# EAGLE schematic cas48 (EAGLE 5.10)
DRAWING_NAME: Unioc 2010; REV: 46
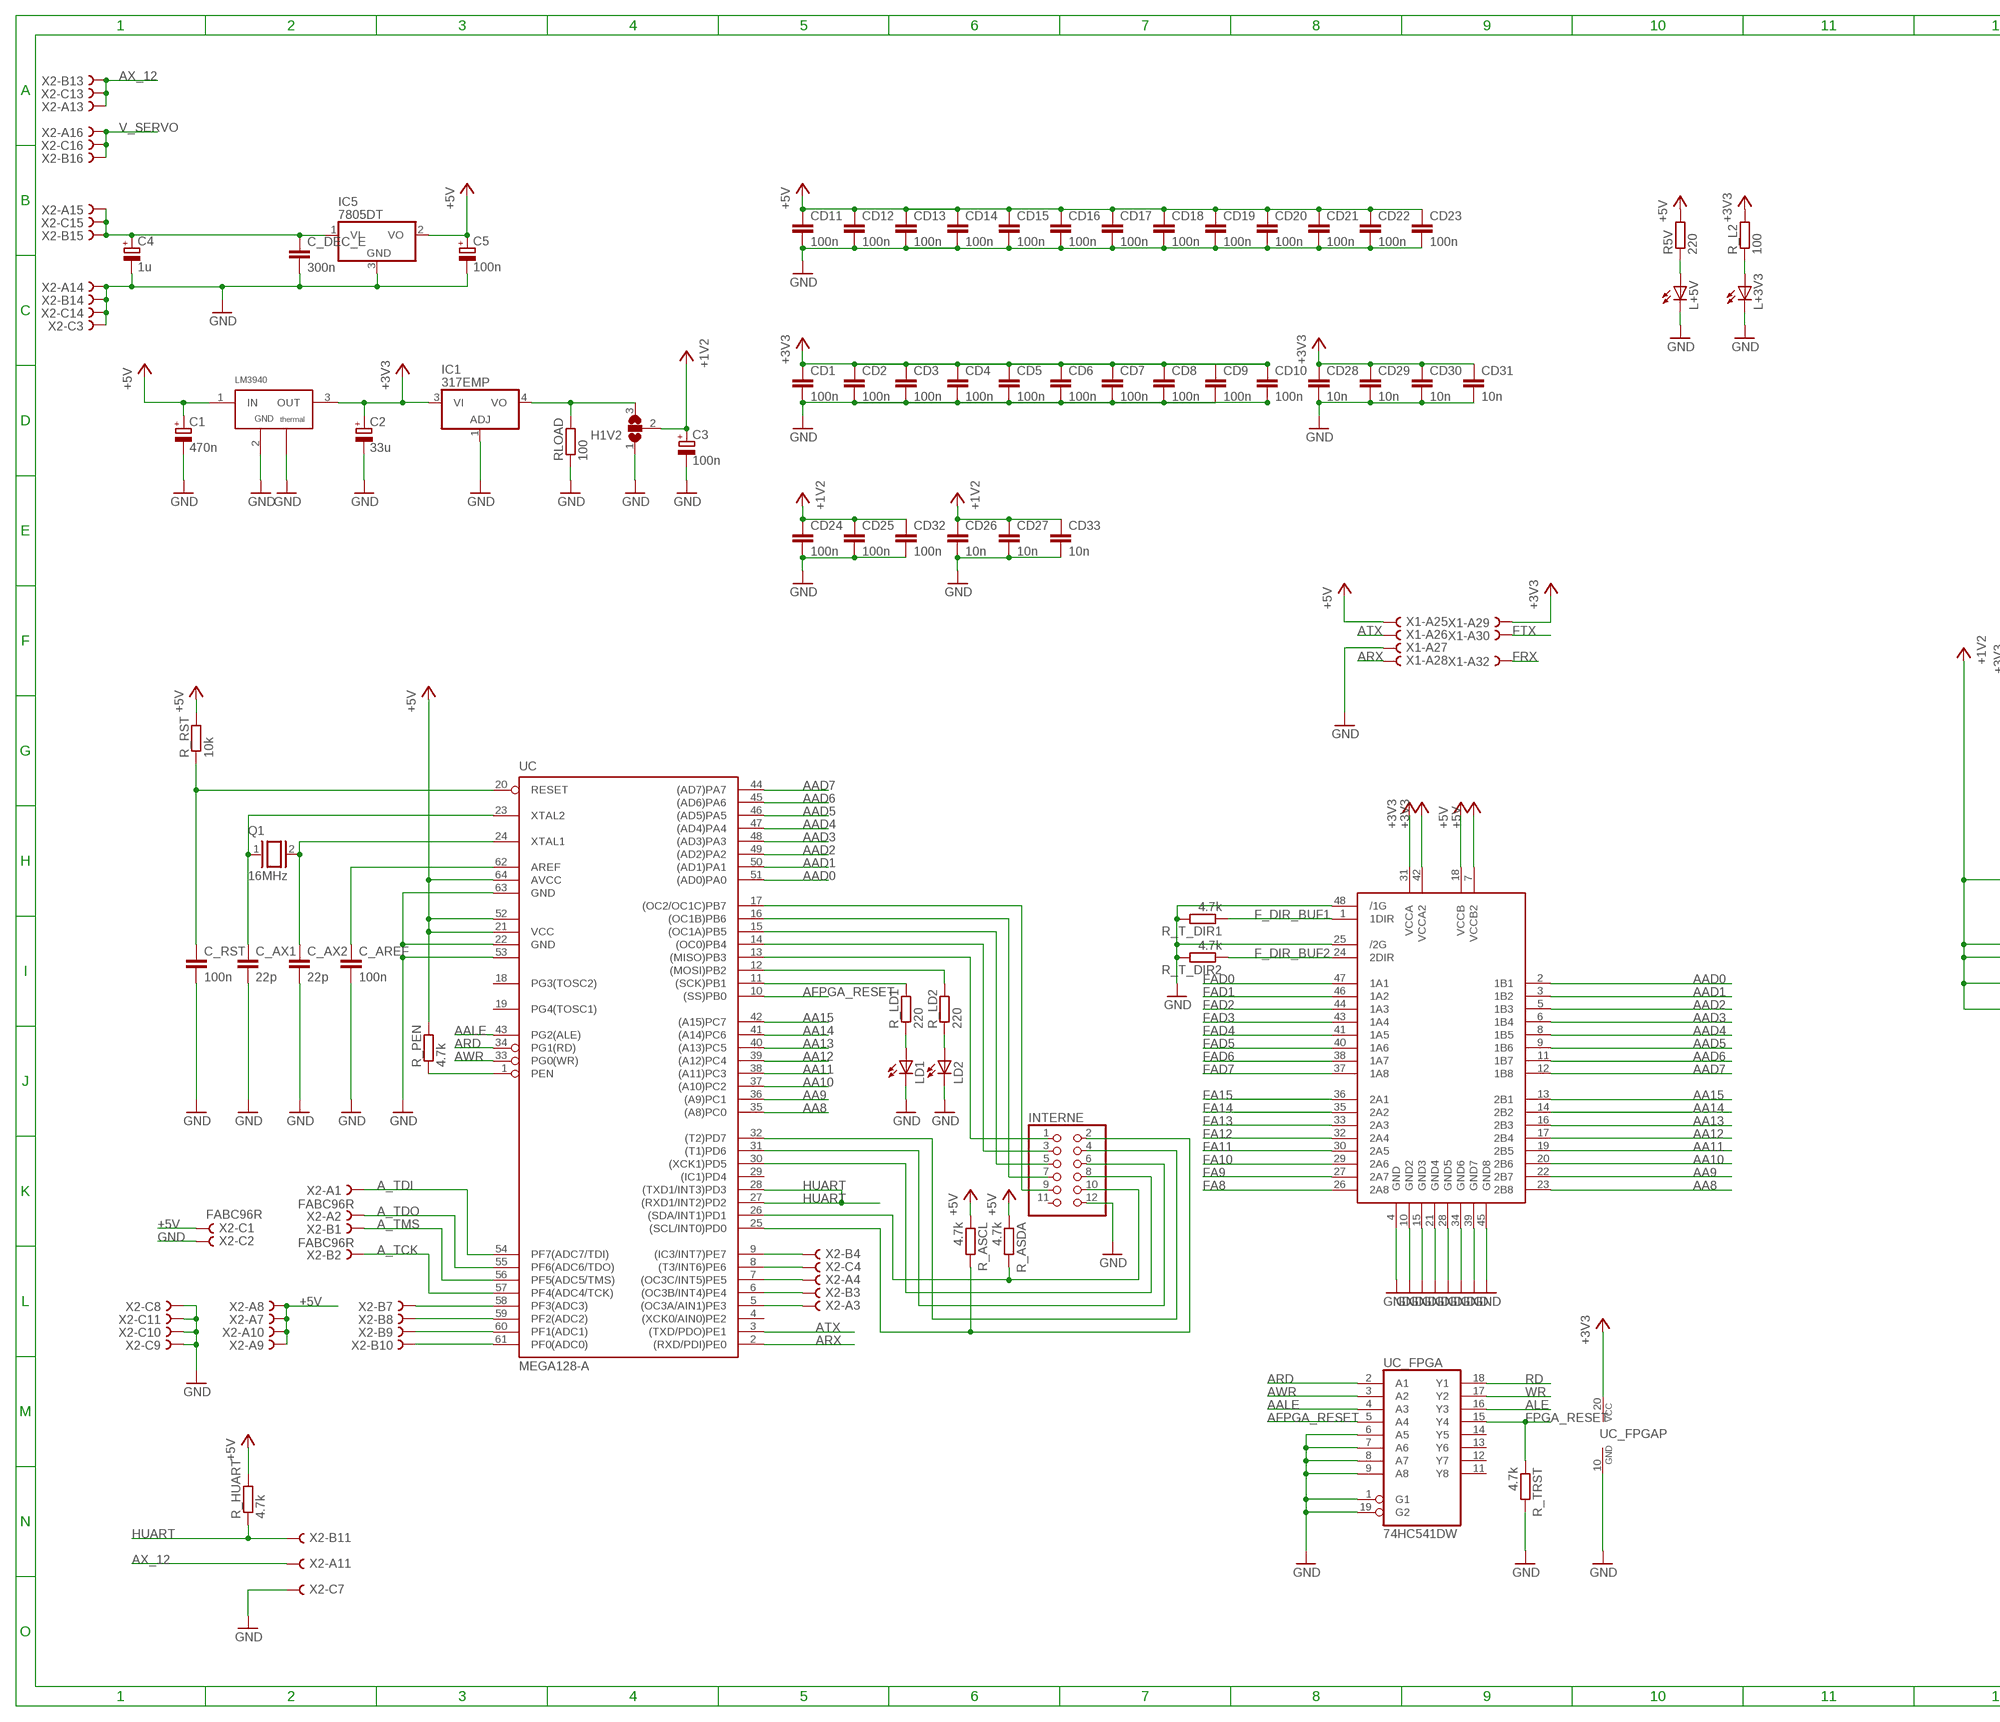
[diagram p0: schematic, sheet 1, part 1 of 2]
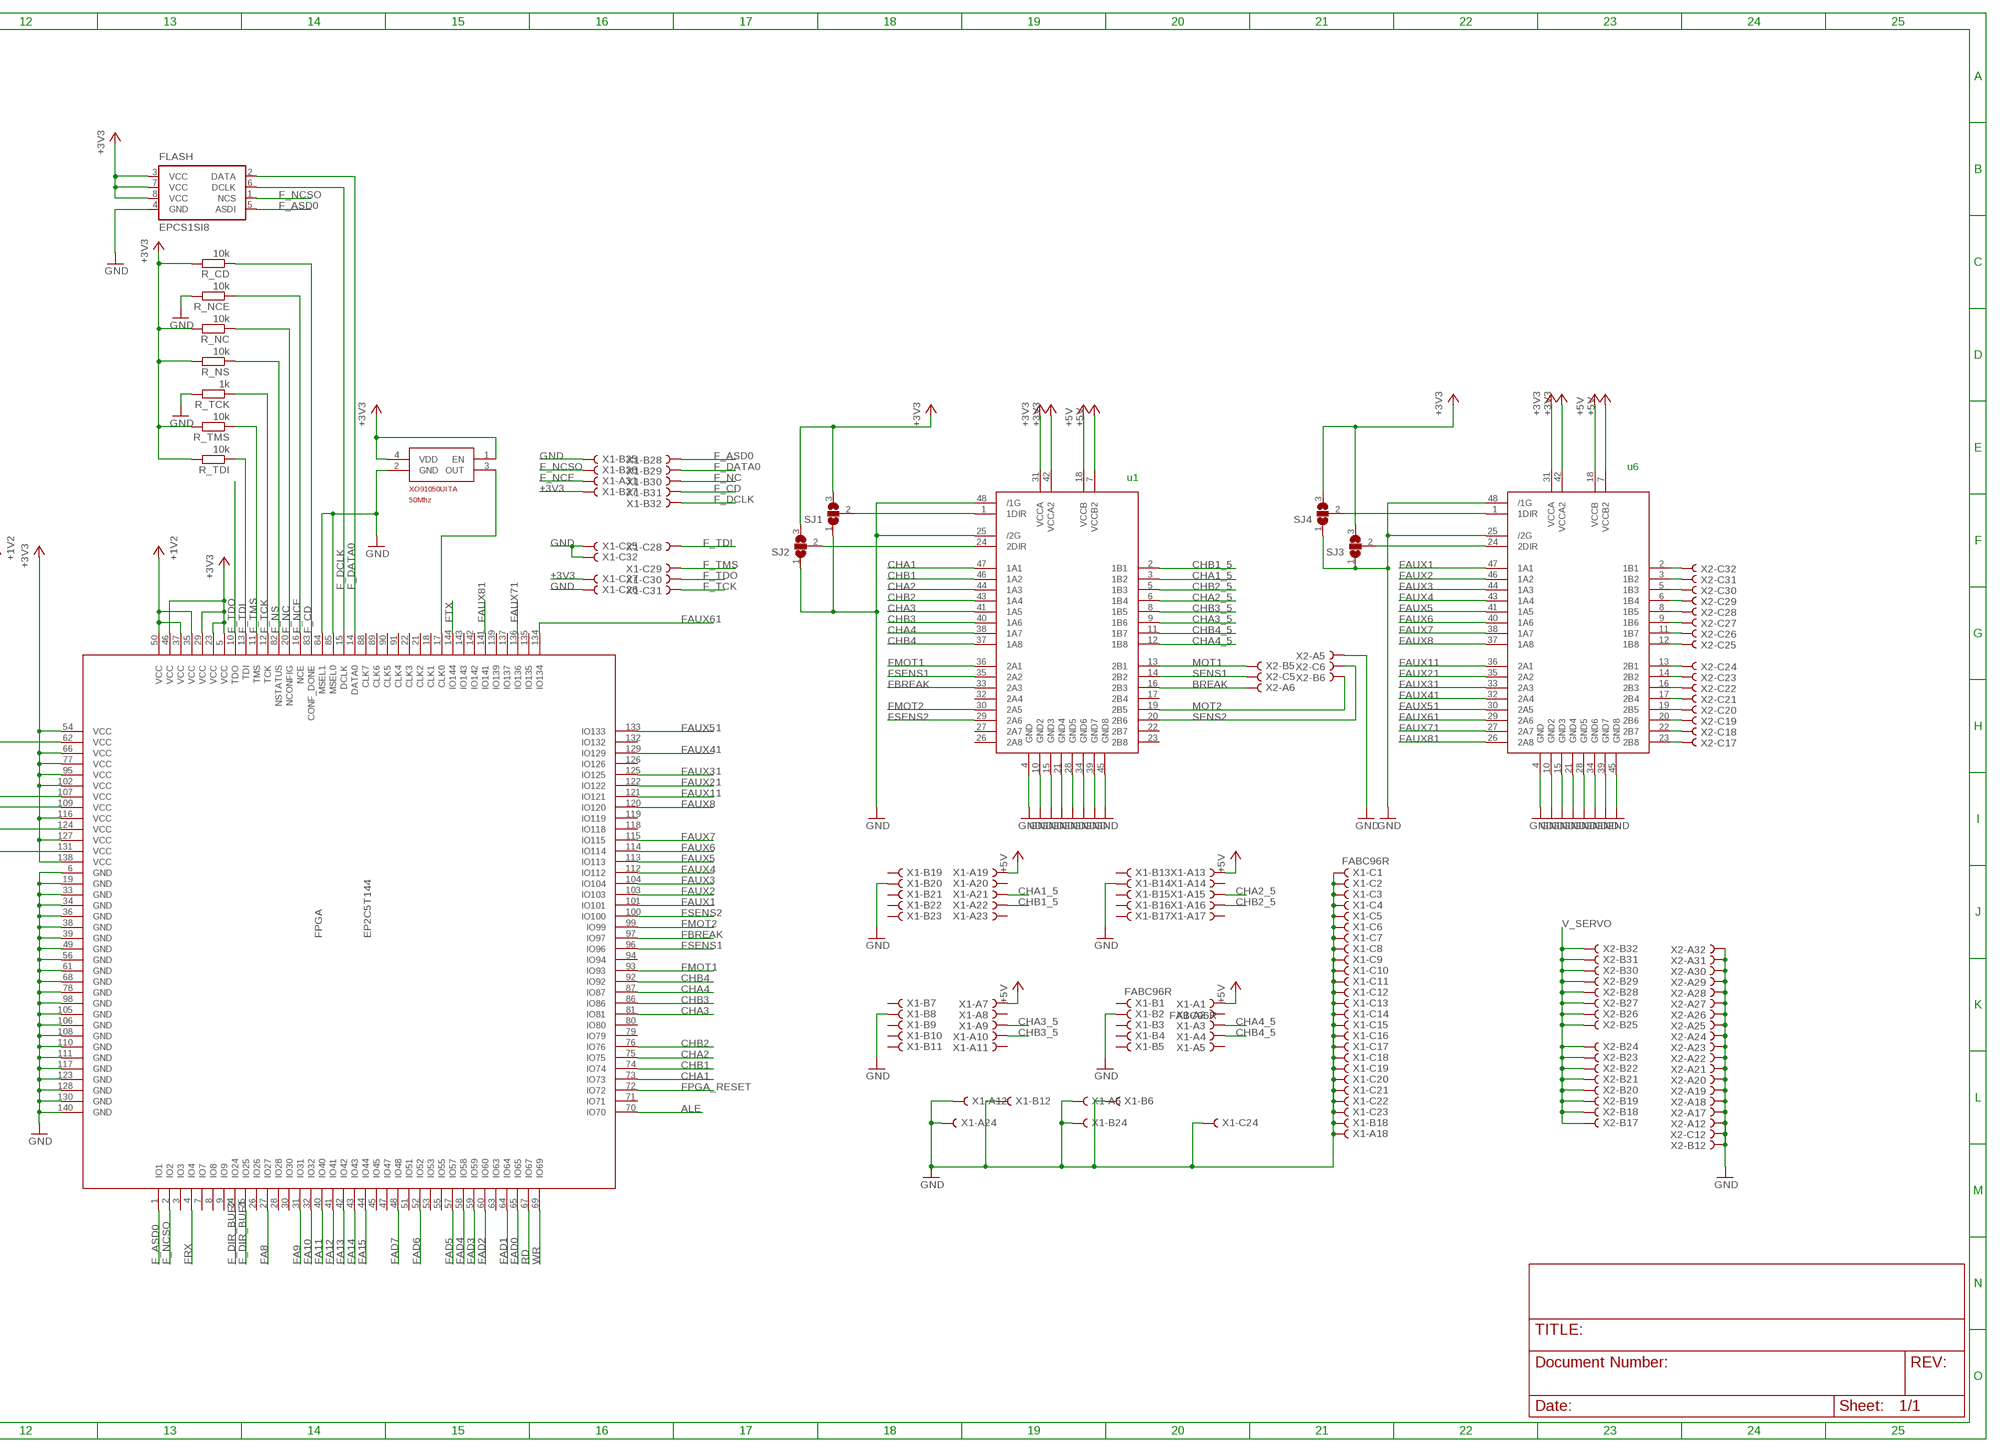
[diagram p1: schematic, sheet 1, part 2 of 2]

## Parts
C1  470n  CPOL-EUE1.8-4  [E1,8-4]
C2  33u  CPOL-EUE1.8-4  [E1,8-4]
C3  100n  CPOL-EUE1.8-4  [E1,8-4]
C4  1u  CPOL-EUE1.8-4  [E1,8-4]
C5  100n  CPOL-EUE1.8-4  [E1,8-4]
C_AREF  100n  C-EUC0805  [C0805]
C_AX1  22p  C-EUC0805  [C0805]
C_AX2  22p  C-EUC0805  [C0805]
C_DEC_E  300n  C-EUC0805  [C0805]
C_RST  100n  C-EUC0805  [C0805]
CD1  100n  C-EUC0805  [C0805]
CD2  100n  C-EUC0805  [C0805]
CD3  100n  C-EUC0805  [C0805]
CD4  100n  C-EUC0805  [C0805]
CD5  100n  C-EUC0805  [C0805]
CD6  100n  C-EUC0805  [C0805]
CD7  100n  C-EUC0805  [C0805]
CD8  100n  C-EUC0805  [C0805]
CD9  100n  C-EUC0805  [C0805]
CD10  100n  C-EUC0805  [C0805]
CD11  100n  C-EUC0805  [C0805]
CD12  100n  C-EUC0805  [C0805]
CD13  100n  C-EUC0805  [C0805]
CD14  100n  C-EUC0805  [C0805]
CD15  100n  C-EUC0805  [C0805]
CD16  100n  C-EUC0805  [C0805]
CD17  100n  C-EUC0805  [C0805]
CD18  100n  C-EUC0805  [C0805]
CD19  100n  C-EUC0805  [C0805]
CD20  100n  C-EUC0805  [C0805]
CD21  100n  C-EUC0805  [C0805]
CD22  100n  C-EUC0805  [C0805]
CD23  100n  C-EUC0805  [C0805]
CD24  100n  C-EUC0805  [C0805]
CD25  100n  C-EUC0805  [C0805]
CD26  10n  C-EUC0805  [C0805]
CD27  10n  C-EUC0805  [C0805]
CD28  10n  C-EUC0805  [C0805]
CD29  10n  C-EUC0805  [C0805]
CD30  10n  C-EUC0805  [C0805]
CD31  10n  C-EUC0805  [C0805]
CD32  100n  C-EUC0805  [C0805]
CD33  10n  C-EUC0805  [C0805]
FLASH  EPCS1SI8  [SO08]
FPGA  EP2C5T144  [TQFP144]
H1V2  SJ2W  [SJ_2]
IC1  317EMP  [SOT223]
IC5  7805DT  [TO252]
INTERNE  PINHD-2X6  [2X06]
L+3V3  LEDCHIPLED_0805  [CHIPLED_0805]
L+5V  LEDCHIPLED_0805  [CHIPLED_0805]
LD1  LEDCHIPLED_0805  [CHIPLED_0805]
LD2  LEDCHIPLED_0805  [CHIPLED_0805]
OSC_FPGA  XO91050UITA-50MHZLEVRAI  [SMD_Q_NG]
Q1  16MHz  XTAL/S  [QS]
R5V  220  R-EU_R0805  [R0805]
R_ASCL  4.7k  R-EU_R0805  [R0805]
R_ASDA  4.7k  R-EU_R0805  [R0805]
R_CD  10k  R-EU_R0805  [R0805]
R_HUART  4.7k  R-EU_R0805  [R0805]
R_L2  100  R-EU_R0805  [R0805]
R_LD1  220  R-EU_R0805  [R0805]
R_LD2  220  R-EU_R0805  [R0805]
R_NC  10k  R-EU_R0805  [R0805]
R_NCE  10k  R-EU_R0805  [R0805]
R_NS  10k  R-EU_R0805  [R0805]
R_PEN  4.7k  R-EU_R0805  [R0805]
R_RST  10k  R-EU_R0805  [R0805]
R_T_DIR1  4.7k  R-EU_R0805  [R0805]
R_T_DIR2  4.7k  R-EU_R0805  [R0805]
R_TCK  1k  R-EU_R0805  [R0805]
R_TDI  10k  R-EU_R0805  [R0805]
R_TMS  10k  R-EU_R0805  [R0805]
R_TRST  4.7k  R-EU_R0805  [R0805]
RLOAD  100  R-EU_0204/7  [0204/7]
SJ1  SJ2W  [SJ_2]
SJ2  SJ2W  [SJ_2]
SJ3  SJ2W  [SJ_2]
SJ4  SJ2W  [SJ_2]
TGPIO  SN74ALVC164245DGGRPACKAGE_MIEU  [N_SOP48]
TSPECIAL  SN74ALVC164245DGGRPACKAGE_MIEU  [N_SOP48]
U$2  LM3940SOT-223  [SOT223]
UC  MEGA128-A  [TQFP64]
UC_FPGA  74HC541DW  [SO20W]
UC_FPGA_AAD  SN74ALVC164245DGGRPACKAGE_MIEU  [N_SOP48]
X1  FABC96R  [FABC96R]
X2  FABC96R  [FABC96R]

## Nets
+1V2: C3.+ CD24.1 CD25.1 CD26.1 CD27.1 CD32.1 CD33.1 FPGA.35(VCC) FPGA.37(VCC) FPGA.50(VCC) FPGA.62(VCC) FPGA.107(VCC) FPGA.109(VCC) FPGA.124(VCC) FPGA.131(VCC) H1V2.2
+3V3: C2.+ CD1.1 CD2.1 CD3.1 CD4.1 CD5.1 CD6.1 CD7.1 CD8.1 CD9.1 CD10.1 CD28.1 CD29.1 CD30.1 CD31.1 FLASH.3(VCC) FLASH.7(VCC) FLASH.8(VCC) FPGA.5(VCC) FPGA.23(VCC) FPGA.29(VCC) FPGA.46(VCC) FPGA.54(VCC) FPGA.66(VCC) FPGA.77(VCC) FPGA.95(VCC) FPGA.102(VCC) FPGA.116(VCC) FPGA.127(VCC) FPGA.138(VCC) IC1.3(VI) OSC_FPGA.1(EN) OSC_FPGA.4(VDD) R_CD.2 R_L2.2 R_NC.2 R_NS.2 R_TDI.2 R_TMS.2 SJ1.3 SJ2.3 SJ3.3 SJ4.3 TGPIO.31(VCCA) TGPIO.42(VCCA2) TSPECIAL.31(VCCA) TSPECIAL.42(VCCA2) U$2.3(OUT) UC_FPGA.20(VCC) UC_FPGA_AAD.31(VCCA) UC_FPGA_AAD.42(VCCA2) X1.A29 X1.B27 X1.C27
+5V: C1.+ C5.+ CD11.1 CD12.1 CD13.1 CD14.1 CD15.1 CD16.1 CD17.1 CD18.1 CD19.1 CD20.1 CD21.1 CD22.1 CD23.1 IC5.2(VO) R5V.2 R_ASCL.1 R_ASDA.1 R_HUART.2 R_PEN.2 R_RST.2 TGPIO.7(VCCB2) TGPIO.18(VCCB) TSPECIAL.7(VCCB2) TSPECIAL.18(VCCB) U$2.1(IN) UC.21(VCC) UC.52(VCC1) UC.64(AVCC) UC_FPGA_AAD.7(VCCB2) UC_FPGA_AAD.18(VCCB) X1.A1 X1.A7 X1.A13 X1.A19 X1.A25 X2.A7 X2.A8 X2.A9 X2.A10 X2.C1
A_TCK: UC.57(PF4(ADC4/TCK)) X2.B2
A_TDI: UC.54(PF7(ADC7/TDI)) X2.A1
A_TDO: UC.55(PF6(ADC6/TDO)) X2.A2
A_TMS: UC.56(PF5(ADC5/TMS)) X2.B1
AA8: UC.35((A8)PC0) UC_FPGA_AAD.23(2B8)
AA9: UC.36((A9)PC1) UC_FPGA_AAD.22(2B7)
AA10: UC.37((A10)PC2) UC_FPGA_AAD.20(2B6)
AA11: UC.38((A11)PC3) UC_FPGA_AAD.19(2B5)
AA12: UC.39((A12)PC4) UC_FPGA_AAD.17(2B4)
AA13: UC.40((A13)PC5) UC_FPGA_AAD.16(2B3)
AA14: UC.41((A14)PC6) UC_FPGA_AAD.14(2B2)
AA15: UC.42((A15)PC7) UC_FPGA_AAD.13(2B1)
AAD0: UC.51((AD0)PA0) UC_FPGA_AAD.2(1B1)
AAD1: UC.50((AD1)PA1) UC_FPGA_AAD.3(1B2)
AAD2: UC.49((AD2)PA2) UC_FPGA_AAD.5(1B3)
AAD3: UC.48((AD3)PA3) UC_FPGA_AAD.6(1B4)
AAD4: UC.47((AD4)PA4) UC_FPGA_AAD.8(1B5)
AAD5: UC.46((AD5)PA5) UC_FPGA_AAD.9(1B6)
AAD6: UC.45((AD6)PA6) UC_FPGA_AAD.11(1B7)
AAD7: UC.44((AD7)PA7) UC_FPGA_AAD.12(1B8)
AALE: UC.43(PG2(ALE)) UC_FPGA.4(A3)
AFPGA_RESET: UC.10((SS)PB0) UC_FPGA.5(A4)
ALE: FPGA.70(IO70) UC_FPGA.16(Y3)
AN0: UC.61(PF0(ADC0)) X2.B10
AN1: UC.60(PF1(ADC1)) X2.B9
AN2: UC.59(PF2(ADC2)) X2.B8
AN3: UC.58(PF3(ADC3)) X2.B7
ARD: UC.34(PG1(RD)) UC_FPGA.2(A1)
AREF: C_AREF.1 UC.62(AREF)
ARST: C_RST.1 R_RST.1 UC.20(RESET)
ARX: UC.2((RXD/PDI)PE0) X1.A28
ATX: UC.3((TXD/PDO)PE1) X1.A26
AUX1: TGPIO.2(1B1) X2.C32
AUX2: TGPIO.3(1B2) X2.C31
AUX3: TGPIO.5(1B3) X2.C30
AUX4: TGPIO.6(1B4) X2.C29
AUX5: TGPIO.8(1B5) X2.C28
AUX6: TGPIO.9(1B6) X2.C27
AUX7: TGPIO.11(1B7) X2.C26
AUX8: TGPIO.12(1B8) X2.C25
AUX11: TGPIO.13(2B1) X2.C24
AUX21: TGPIO.14(2B2) X2.C23
AUX31: TGPIO.16(2B3) X2.C22
AUX41: TGPIO.17(2B4) X2.C21
AUX51: TGPIO.19(2B5) X2.C20
AUX61: TGPIO.20(2B6) X2.C19
AUX71: TGPIO.22(2B7) X2.C18
AUX81: TGPIO.23(2B8) X2.C17
AWR: UC.33(PG0(WR)) UC_FPGA.3(A2)
AX_12: X2.A11 X2.A13 X2.B13 X2.C13
BREAK: TSPECIAL.16(2B3) X2.A6
CHA1: FPGA.73(IO73) TSPECIAL.47(1A1)
CHA1_5: TSPECIAL.3(1B2) X1.A21
CHA2: FPGA.75(IO75) TSPECIAL.44(1A3)
CHA2_5: TSPECIAL.6(1B4) X1.A15
CHA3: FPGA.81(IO81) TSPECIAL.41(1A5)
CHA3_5: TSPECIAL.9(1B6) X1.A9
CHA4: FPGA.87(IO87) TSPECIAL.38(1A7)
CHA4_5: TSPECIAL.12(1B8) X1.A3
CHB1: FPGA.74(IO74) TSPECIAL.46(1A2)
CHB1_5: TSPECIAL.2(1B1) X1.A22
CHB2: FPGA.76(IO76) TSPECIAL.43(1A4)
CHB2_5: TSPECIAL.5(1B3) X1.A16
CHB3: FPGA.86(IO86) TSPECIAL.40(1A6)
CHB3_5: TSPECIAL.8(1B5) X1.A10
CHB4: FPGA.92(IO92) TSPECIAL.37(1A8)
CHB4_5: TSPECIAL.11(1B7) X1.A4
CLK0: FPGA.17(CLK0) OSC_FPGA.3(OUT)
F_ASD0: FLASH.5(ASDI) FPGA.1(IO1) X1.B28
F_CD: FPGA.83(CONF_DONE) R_CD.1 X1.B31
F_DATA0: FLASH.2(DATA) FPGA.14(DATA0) X1.B29
F_DCLK: FLASH.6(DCLK) FPGA.15(DCLK) X1.B32
F_DIR_BUF1: FPGA.25(IO25) R_T_DIR1.1 UC_FPGA_AAD.1(1DIR)
F_DIR_BUF2: FPGA.24(IO24) R_T_DIR2.1 UC_FPGA_AAD.24(2DIR)
F_NC: FPGA.20(NCONFIG) R_NC.1 X1.B30
F_NCE: FPGA.16(NCE) R_NCE.1 X1.A31
F_NCSO: FLASH.1(NCS) FPGA.2(IO2) X1.B26
F_NS: FPGA.82(NSTATUS) R_NS.1
F_TCK: FPGA.12(TCK) R_TCK.1 X1.C31
F_TDI: FPGA.13(TDI) R_TDI.1 X1.C28
F_TDO: FPGA.10(TDO) X1.C30
F_TMS: FPGA.11(TMS) R_TMS.1 X1.C29
FA8: FPGA.27(IO27) UC_FPGA_AAD.26(2A8)
FA9: FPGA.31(IO31) UC_FPGA_AAD.27(2A7)
FA10: FPGA.32(IO32) UC_FPGA_AAD.29(2A6)
FA11: FPGA.40(IO40) UC_FPGA_AAD.30(2A5)
FA12: FPGA.41(IO41) UC_FPGA_AAD.32(2A4)
FA13: FPGA.42(IO42) UC_FPGA_AAD.33(2A3)
FA14: FPGA.43(IO43) UC_FPGA_AAD.35(2A2)
FA15: FPGA.44(IO44) UC_FPGA_AAD.36(2A1)
FAD0: FPGA.65(IO65) UC_FPGA_AAD.47(1A1)
FAD1: FPGA.64(IO64) UC_FPGA_AAD.46(1A2)
FAD2: FPGA.60(IO60) UC_FPGA_AAD.44(1A3)
FAD3: FPGA.59(IO59) UC_FPGA_AAD.43(1A4)
FAD4: FPGA.58(IO58) UC_FPGA_AAD.41(1A5)
FAD5: FPGA.57(IO57) UC_FPGA_AAD.40(1A6)
FAD6: FPGA.52(IO52) UC_FPGA_AAD.38(1A7)
FAD7: FPGA.48(IO48) UC_FPGA_AAD.37(1A8)
FAUX1: FPGA.101(IO101) TGPIO.47(1A1)
FAUX2: FPGA.103(IO103) TGPIO.46(1A2)
FAUX3: FPGA.104(IO104) TGPIO.44(1A3)
FAUX4: FPGA.112(IO112) TGPIO.43(1A4)
FAUX5: FPGA.113(IO113) TGPIO.41(1A5)
FAUX6: FPGA.114(IO114) TGPIO.40(1A6)
FAUX7: FPGA.115(IO115) TGPIO.38(1A7)
FAUX8: FPGA.120(IO120) TGPIO.37(1A8)
FAUX11: FPGA.121(IO121) TGPIO.36(2A1)
FAUX21: FPGA.122(IO122) TGPIO.35(2A2)
FAUX31: FPGA.125(IO125) TGPIO.33(2A3)
FAUX41: FPGA.129(IO129) TGPIO.32(2A4)
FAUX51: FPGA.133(IO133) TGPIO.30(2A5)
FAUX61: FPGA.134(IO134) TGPIO.29(2A6)
FAUX71: FPGA.136(IO136) TGPIO.27(2A7)
FAUX81: FPGA.141(IO141) TGPIO.26(2A8)
FBREAK: FPGA.97(IO97) TSPECIAL.33(2A3)
FMOT1: FPGA.93(IO93) TSPECIAL.36(2A1)
FMOT2: FPGA.99(IO99) TSPECIAL.30(2A5)
FPGA_RESET: FPGA.72(IO72) R_TRST.1 UC_FPGA.15(Y4)
FRX: FPGA.4(IO4) X1.A32
FSENS1: FPGA.96(IO96) TSPECIAL.35(2A2)
FSENS2: FPGA.100(IO100) TSPECIAL.29(2A6)
FTX: FPGA.144(IO144) X1.A30
GND: C1.- C2.- C3.- C4.- C5.- C_AREF.2 C_AX1.2 C_AX2.2 C_DEC_E.2 C_RST.2 CD1.2 CD2.2 CD3.2 CD4.2 CD5.2 CD6.2 CD7.2 CD8.2 CD9.2 CD10.2 CD11.2 CD12.2 CD13.2 CD14.2 CD15.2 CD16.2 CD17.2 CD18.2 CD19.2 CD20.2 CD21.2 CD22.2 CD23.2 CD24.2 CD25.2 CD26.2 CD27.2 CD28.2 CD29.2 CD30.2 CD31.2 CD32.2 CD33.2 FLASH.4(GND) FPGA.6(GND) FPGA.19(GND) FPGA.33(GND) FPGA.34(GND) FPGA.36(GND) FPGA.38(GND) FPGA.39(GND) FPGA.49(GND) FPGA.56(GND) FPGA.61(GND) FPGA.68(GND) FPGA.78(GND) FPGA.84(MSEL1) FPGA.85(MSEL0) FPGA.98(GND) FPGA.105(GND) FPGA.106(GND) FPGA.108(GND) FPGA.110(GND) FPGA.111(GND) FPGA.117(GND) FPGA.123(GND) FPGA.128(GND) FPGA.130(GND) FPGA.140(GND) H1V2.1 IC1.1(ADJ) IC5.3(GND) INTERNE.12 L+3V3.C L+5V.C LD1.C LD2.C OSC_FPGA.2(GND) R_NCE.2 R_T_DIR1.2 R_T_DIR2.2 R_TCK.2 R_TRST.2 RLOAD.1 SJ1.1 SJ2.1 SJ3.1 SJ4.1 TGPIO.4(GND) TGPIO.10(GND2) TGPIO.15(GND3) TGPIO.21(GND4) TGPIO.25(/2G) TGPIO.28(GND5) TGPIO.34(GND6) TGPIO.39(GND7) TGPIO.45(GND8) TGPIO.48(/1G) TSPECIAL.4(GND) TSPECIAL.10(GND2) TSPECIAL.15(GND3) TSPECIAL.21(GND4) TSPECIAL.25(/2G) TSPECIAL.28(GND5) TSPECIAL.34(GND6) TSPECIAL.39(GND7) TSPECIAL.45(GND8) TSPECIAL.48(/1G) U$2.2(GND) U$2.4(THM) UC.22(GND) UC.53(GND1) UC.63(GND) UC_FPGA.1(G1) UC_FPGA.6(A5) UC_FPGA.7(A6) UC_FPGA.8(A7) UC_FPGA.9(A8) UC_FPGA.10(GND) UC_FPGA.19(G2) UC_FPGA_AAD.4(GND) UC_FPGA_AAD.10(GND2) UC_FPGA_AAD.15(GND3) UC_FPGA_AAD.21(GND4) UC_FPGA_AAD.25(/2G) UC_FPGA_AAD.28(GND5) UC_FPGA_AAD.34(GND6) UC_FPGA_AAD.39(GND7) UC_FPGA_AAD.45(GND8) UC_FPGA_AAD.48(/1G) X1.A6 X1.A12 X1.A18 X1.A24 X1.A27 X1.B2 X1.B6 X1.B8 X1.B12 X1.B14 X1.B18 X1.B20 X1.B24 X1.B25 X1.C1 X1.C2 X1.C3 X1.C4 X1.C5 X1.C6 X1.C7 X1.C8 X1.C9 X1.C10 X1.C11 X1.C12 X1.C13 X1.C14 X1.C15 X1.C16 X1.C17 X1.C18 X1.C19 X1.C20 X1.C21 X1.C22 X1.C23 X1.C24 X1.C25 X1.C26 X1.C32 X2.A5 X2.A12 X2.A14 X2.A17 X2.A18 X2.A19 X2.A20 X2.A21 X2.A22 X2.A23 X2.A24 X2.A25 X2.A26 X2.A27 X2.A28 X2.A29 X2.A30 X2.A31 X2.A32 X2.B12 X2.B14 X2.C2 X2.C3 X2.C7 X2.C8 X2.C9 X2.C10 X2.C11 X2.C12 X2.C14
GPDIR1: SJ4.2 TGPIO.1(1DIR)
GPDIR2: SJ3.2 TGPIO.24(2DIR)
HUART: R_HUART.1 UC.27((RXD1/INT2)PD2) UC.28((TXD1/INT3)PD3) X2.B11
IO3: UC.5((OC3A/AIN1)PE3) X2.A3
IO4: UC.6((OC3B/INT4)PE4) X2.B3
IO5: UC.7((OC3C/INT5)PE5) X2.A4
IO6: UC.8((T3/INT6)PE6) X2.C4
IO7: UC.9((IC3/INT7)PE7) X2.B4
IOE1: INTERNE.8 UC.30((XCK1)PD5)
IOE2: INTERNE.6 UC.31((T1)PD6)
IOE3: INTERNE.4 UC.32((T2)PD7)
IOE4: INTERNE.1 UC.13((MISO)PB3)
IOE5: INTERNE.3 UC.14((OC0)PB4)
IOE6: INTERNE.5 UC.15((OC1A)PB5)
IOE7: INTERNE.7 UC.16((OC1B)PB6)
IOE8: INTERNE.9 UC.17((OC2/OC1C)PB7)
MOT1: TSPECIAL.13(2B1) X2.B5
MOT2: TSPECIAL.19(2B5) X2.B6
N$10: LD2.A R_LD2.1
N$11: LD1.A R_LD1.1
N$12: R_LD1.2 UC.11((SCK)PB1)
N$13: R_LD2.2 UC.12((MOSI)PB2)
N$77: C4.+ C_DEC_E.1 IC5.1(VI) X2.A15 X2.B15 X2.C15
NL3: L+3V3.A R_L2.1
NL5: L+5V.A R5V.1
PEN: R_PEN.1 UC.1(PEN)
PI+1V2: H1V2.3 IC1.4(VO) RLOAD.2
RD: FPGA.67(IO67) UC_FPGA.18(Y1)
SCL: INTERNE.2 R_ASCL.2 UC.25((SCL/INT0)PD0)
SDA: INTERNE.10 R_ASDA.2 UC.26((SDA/INT1)PD1)
SENS1: TSPECIAL.14(2B2) X2.C5
SENS2: TSPECIAL.20(2B6) X2.C6
SP_DIR1: SJ1.2 TSPECIAL.1(1DIR)
SPDIR2: SJ2.2 TSPECIAL.24(2DIR)
V_SERVO: X2.A16 X2.B16 X2.B17 X2.B18 X2.B19 X2.B20 X2.B21 X2.B22 X2.B23 X2.B24 X2.B25 X2.B26 X2.B27 X2.B28 X2.B29 X2.B30 X2.B31 X2.B32 X2.C16
WR: FPGA.69(IO69) UC_FPGA.17(Y2)
X1: C_AX1.1 Q1.1 UC.23(XTAL2)
X2: C_AX2.1 Q1.2 UC.24(XTAL1)
Unconnected: FPGA.3(IO3) FPGA.7(IO7) FPGA.8(IO8) FPGA.9(IO9) FPGA.18(CLK1) FPGA.21(CLK2) FPGA.22(CLK3) FPGA.26(IO26) FPGA.28(IO28) FPGA.30(IO30) FPGA.45(IO45) FPGA.47(IO47) FPGA.51(IO51) FPGA.53(IO53) FPGA.55(IO55) FPGA.63(IO63) FPGA.71(IO71) FPGA.79(IO79) FPGA.80(IO80) FPGA.88(CLK7) FPGA.89(CLK6) FPGA.90(CLK5) FPGA.91(CLK4) FPGA.94(IO94) FPGA.118(IO118) FPGA.119(IO119) FPGA.126(IO126) FPGA.132(IO132) FPGA.135(IO135) FPGA.137(IO137) FPGA.139(IO139) FPGA.142(IO142) FPGA.143(IO143) INTERNE.11 TSPECIAL.17(2B4) TSPECIAL.22(2B7) TSPECIAL.23(2B8) TSPECIAL.26(2A8) TSPECIAL.27(2A7) TSPECIAL.32(2A4) UC.4((XCK0/AIN0)PE2) UC.18(PG3(TOSC2)) UC.19(PG4(TOSC1)) UC.29((IC1)PD4) UC_FPGA.11(Y8) UC_FPGA.12(Y7) UC_FPGA.13(Y6) UC_FPGA.14(Y5) X1.A2 X1.A5 X1.A8 X1.A11 X1.A14 X1.A17 X1.A20 X1.A23 X1.B1 X1.B3 X1.B4 X1.B5 X1.B7 X1.B9 X1.B10 X1.B11 X1.B13 X1.B15 X1.B16 X1.B17 X1.B19 X1.B21 X1.B22 X1.B23

## Notes on the sheet
- u6
- u1

## Library data of the parts
C1-C5 = rcl:CPOL-EU: POLARIZED CAPACITOR, European symbol
C_AREF C_AX1 C_AX2 C_DEC_E C_RST CD1-CD33 = rcl:C-EU: CAPACITOR, European symbol
FLASH = altera-2:EPCS1: 1 Mbit Serial Configuration Device
FPGA = altera-cyclone-II:EP2C5T144: EP2C5T144 Auto generated by make-symbol-device-package-bsdl.ulp Rev. 19 Tip: Use split-device-symbol.ulp to generate a Device with multiple small symbols! Read HELP. Source: EP2C5T144.BSD
H1V2 SJ1-SJ4 = jumper:SJ2W: SMD solder JUMPER
IC1 = linear:*317: Positive VOLTAGE REGULATOR
IC5 = linear:78*: Positive VOLTAGE REGULATOR Source: http://cache.national.com/ds/LM/LM78L05.pdf http://www.fairchildsemi.com/ds/LM/LM7805.pdf
INTERNE = pinhead:PINHD-2X6: PIN HEADER
L+3V3 L+5V LD1 LD2 = led:LED: LED OSRAM: - CHIPLED LG R971, LG N971, LY N971, LG Q971, LY Q971, LO R971, LY R971 LH N974, LH R974 LS Q976, LO Q976, LY Q976 LO Q996 - Hyper CHIPLED LW Q18S LB Q993, LB Q99A, LB R99A - SideLED LS A670, LO A670, LY A670, LG A670, LP A670 LB A673, LV A673, LT A673, LW A673 LH A674 LY A675 LS A676, LA A676, LO A676, LY A676, LW A676 LS A679, LY A679, LG A679 - Hyper Micro SIDELED® LS Y876, LA Y876, LO Y876, LY Y876 LT Y87S - SmartLED LW L88C, LW L88S LB L89C, LB L89S, LG L890 LS L89K, LO L89K, LY L89K LS L896, LA L896, LO L896, LY L896 - TOPLED LS T670, LO T670, LY T670, LG T670, LP T670 LSG T670, LSP T670, LSY T670, LOP T670, LYG T670 LG T671, LOG T671, LSG T671 LB T673, LV T673, LT T673, LW T673 LH T674 LS T676, LA T676, LO T676, LY T676, LB T676, LH T676, LSB T676, LW T676 LB T67C, LV T67C, LT T67C, LS T67K, LO T67K, LY T67K, LW E67C LS E67B, LA E67B, LO E67B, LY E67B, LB E67C, LV E67C, LT E67C LW T67C LS T679, LY T679, LG T679 LS T770, LO T770, LY T770, LG T770, LP T770 LB T773, LV T773, LT T773, LW T773 LH T774 LS E675, LA E675, LY E675, LS T675 LS T776, LA T776, LO T776, LY T776, LB T776 LHGB T686 LT T68C, LB T68C - Hyper Mini TOPLED® LB M676 - Mini TOPLED Santana® LG M470 LS M47K, LO M47K, LY M47K Source: http://www.osram.convergy.de LUXEON: - LUMILED® LXK2-PW12-R00, LXK2-PW12-S00, LXK2-PW14-U00, LXK2-PW14-V00 LXK2-PM12-R00, LXK2-PM12-S00, LXK2-PM14-U00 LXK2-PE12-Q00, LXK2-PE12-R00, LXK2-PE12-S00, LXK2-PE14-T00, LXK2-PE14-U00 LXK2-PB12-K00, LXK2-PB12-L00, LXK2-PB12-M00, LXK2-PB14-N00, LXK2-PB14-P00, LXK2-PB14-Q00 LXK2-PR12-L00, LXK2-PR12-M00, LXK2-PR14-Q00, LXK2-PR14-R00 LXK2-PD12-Q00, LXK2-PD12-R00, LXK2-PD12-S00 LXK2-PH12-R00, LXK2-PH12-S00 LXK2-PL12-P00, LXK2-PL12-Q00, LXK2-PL12-R00 Source: www.luxeon.com KINGBRIGHT: KA-3528ASYC Source: www.kingbright.com
OSC_FPGA = damien:XO91050UITA-50MHZ: Oscillateur à quartz - 50MHz
Q1 = special:XTAL/S: CRYSTAL
R5V R_ASCL R_ASDA R_CD R_HUART R_L2 R_LD1 R_LD2 R_NC R_NCE R_NS R_PEN R_RST R_T_DIR1 R_T_DIR2 R_TCK R_TDI R_TMS R_TRST RLOAD = rcl:R-EU_: RESISTOR, European symbol
TGPIO TSPECIAL UC_FPGA_AAD = damien:SN74ALVC164245DGGR
U$2 = ns:LM3940
UC = atmel:MEGA128: MICROCONTROLLER 128 Kbytes FLASH 4 Kbytes SRAM 4 Kbytes EEPROM DUAL USART 8-channel 10 bit ADC Source: avr.lbr
UC_FPGA = 74xx-eu:74*541: Octal BUFFER and LINE DRIVER, 3-state
X1 X2 = con-vg:FABC96R: CONNECTOR female, 96 pins, type R, rows ABC, grid 2.54 mm